# Altium schematic sheet MCU.SchDoc
size 353 x 250 mm; Date: 17.10.2024r.; Author: Bartłomiej Smoter; CompanyName: AGH Racing; Revision: v1; SheetNumber: 4; SheetTotal: 6
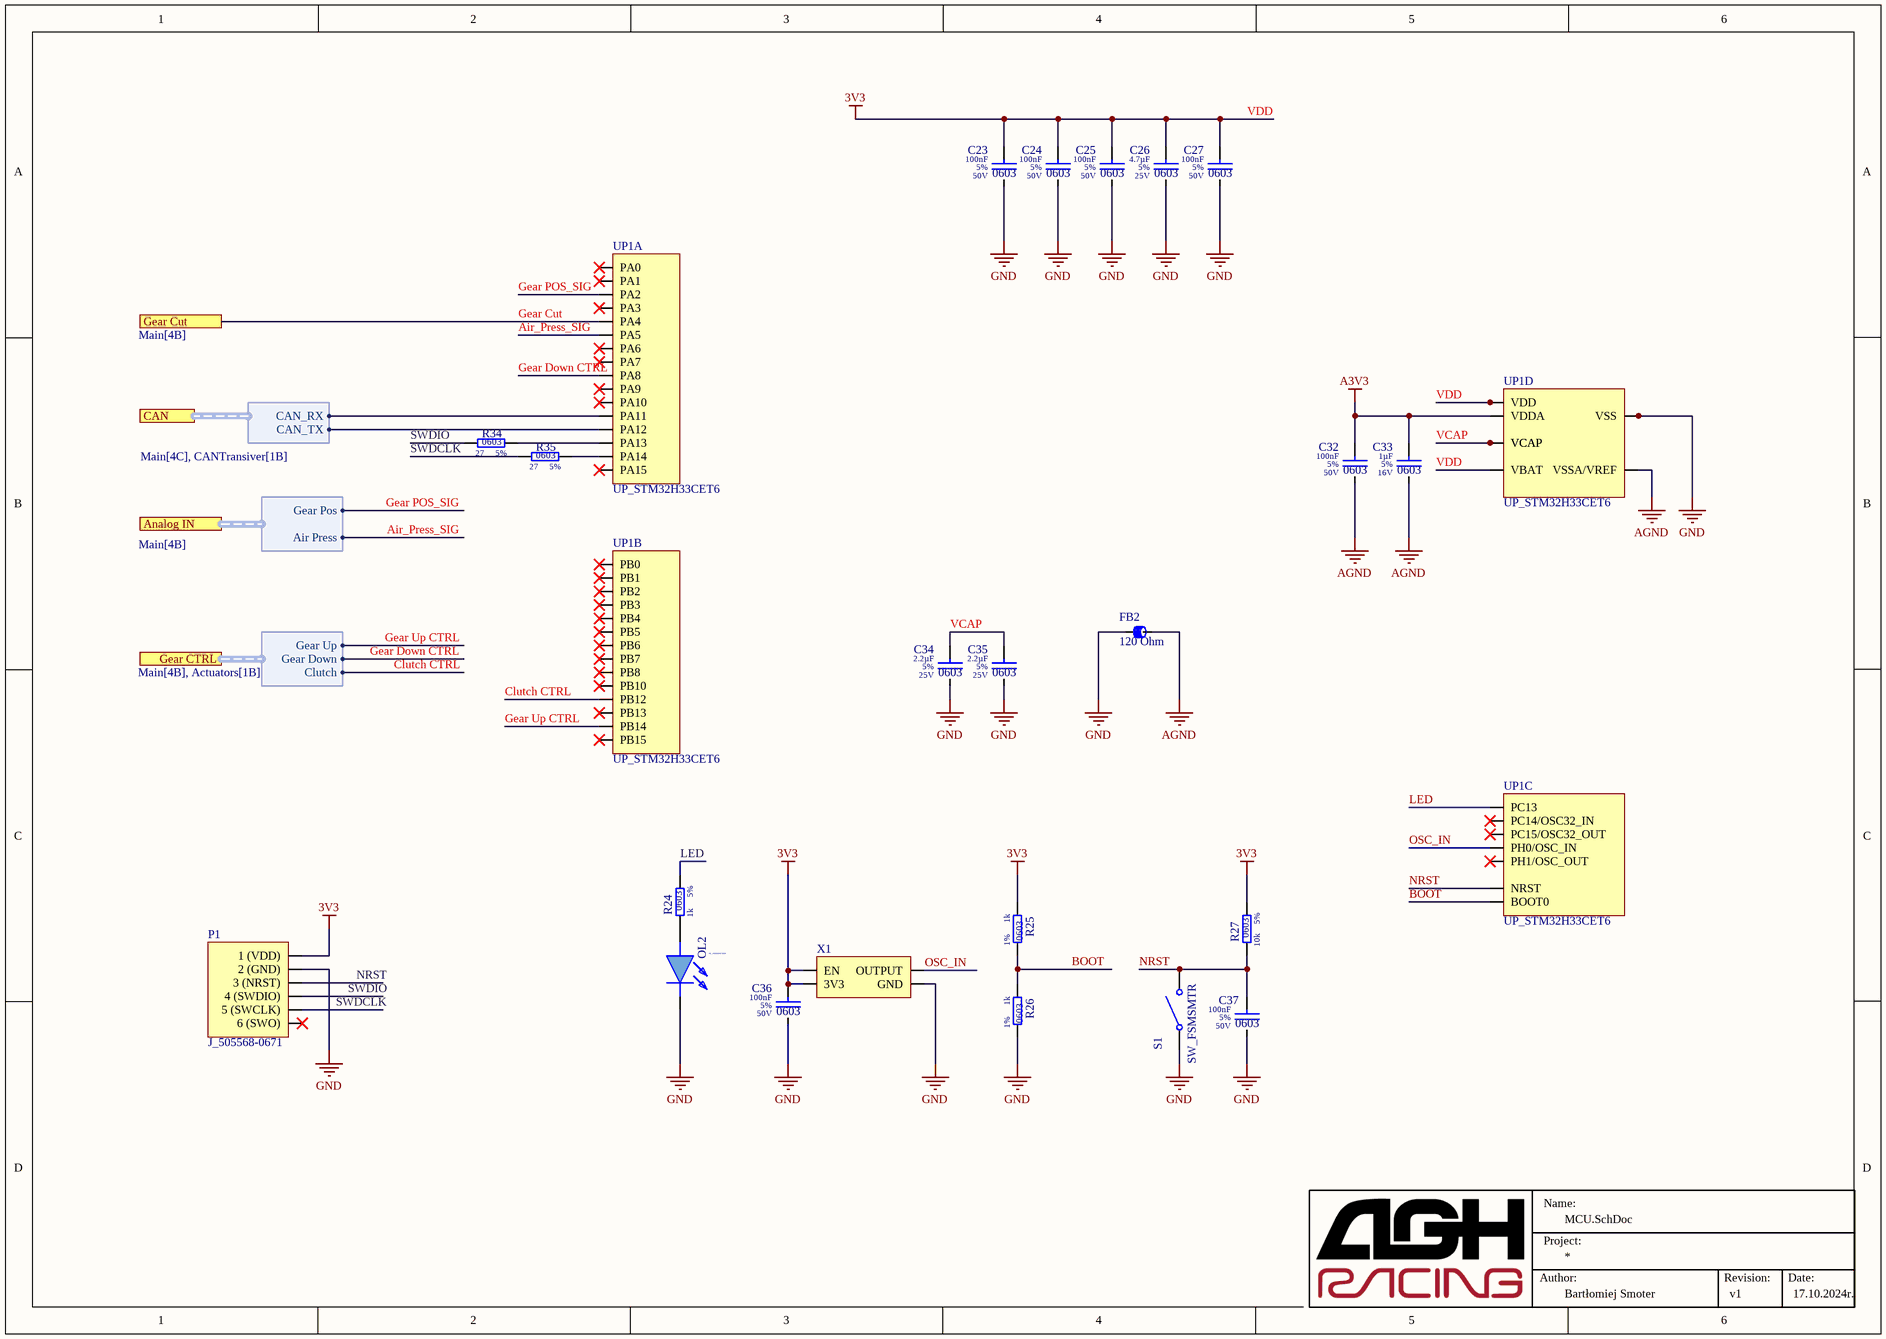
[diagram p0: MCU.SchDoc]

## Parts
C23  value 100nF  Tolerance: 5%  Voltage Rating: 50V  Case/Package: 0603  [0603_HandSold_Capacitor]  (hidden comment: C_100n_50V_0603_5)
C24  value 100nF  Tolerance: 5%  Voltage Rating: 50V  Case/Package: 0603  [0603_HandSold_Capacitor]  (hidden comment: C_100n_50V_0603_5)
C25  value 100nF  Tolerance: 5%  Voltage Rating: 50V  Case/Package: 0603  [0603_HandSold_Capacitor]  (hidden comment: C_100n_50V_0603_5)
C26  value 4.7µF  Tolerance: 5%  Voltage Rating: 25V  Case/Package: 0603  [0603_HandSold_Capacitor]  (hidden comment: C_4.7u_25V_0603_5)
C27  value 100nF  Tolerance: 5%  Voltage Rating: 50V  Case/Package: 0603  [0603_HandSold_Capacitor]  (hidden comment: C_100n_50V_0603_5)
C32  value 100nF  Tolerance: 5%  Voltage Rating: 50V  Case/Package: 0603  [0603_HandSold_Capacitor]  (hidden comment: C_100n_50V_0603_5)
C33  value 1µF  Tolerance: 5%  Voltage Rating: 16V  Case/Package: 0603  [0603_HandSold_Capacitor]  (hidden comment: C_1u_16V_0603_5)
C34  value 2.2µF  Tolerance: 5%  Voltage Rating: 25V  Case/Package: 0603  [0603_HandSold_Capacitor]  (hidden comment: C_2.2u_25V_0603_5)
C35  value 2.2µF  Tolerance: 5%  Voltage Rating: 25V  Case/Package: 0603  [0603_HandSold_Capacitor]  (hidden comment: C_2.2u_25V_0603_5)
C36  value 100nF  Tolerance: 5%  Voltage Rating: 50V  Case/Package: 0603  [0603_HandSold_Capacitor]  (hidden comment: C_100n_50V_0603_5)
C37  value 100nF  Tolerance: 5%  Voltage Rating: 50V  Case/Package: 0603  [0603_HandSold_Capacitor]  (hidden comment: C_100n_50V_0603_5)
FB2  Impedance: 120 Ohm  [0805_FB]  (hidden comment: FB_BLM21PG121SN1D)
OL2  OL_150060BS75000  [0603_HandSold_LED]
P1  J_505568-0671  [505568-0671]
R24  Tolerance: 5%  Resistance: 1k  Case/Package: 0603  [0603_HandSold_Resistor]  (hidden comment: R_1k_0603_5)
R25  Tolerance: 1%  Resistance: 1k  Case/Package: 0603  [0603_HandSold_Resistor]  (hidden comment: R_1k_0603_1)
R26  Tolerance: 1%  Resistance: 1k  Case/Package: 0603  [0603_HandSold_Resistor]  (hidden comment: R_1k_0603_1)
R27  Tolerance: 5%  Resistance: 10k  Case/Package: 0603  [0603_HandSold_Resistor]  (hidden comment: R_10k_0603_5)
R34  Tolerance: 5%  Resistance: 27  Case/Package: 0603  [0603_HandSold_Resistor]  (hidden comment: R_27_0603_5)
R35  Tolerance: 5%  Resistance: 27  Case/Package: 0603  [0603_HandSold_Resistor]  (hidden comment: R_27_0603_5)
S1  SW_FSMSMTR  [TECO-FSMSMTR_V]
UP1  UP_STM32H33CET6  [LQFP48]  (parts A,B,C,D of 4)
X1  X_16MHz_LFSPXO066657CUTT  [X_2mm_2.5mm_oscillator]  (value not drawn)

## Ports
Analog IN (harness ANAL, see Main[4B]), CAN (harness CAN, see Main[4C], CANTransiver[1B]), Gear CTRL (harness Gears, see Main[4B], Actuators[1B]), Gear Cut (see Main[4B])

## Harnesses
CAN: CAN_RX, CAN_TX
Gears: Gear Up, Gear Down, Clutch
ANAL: Gear Pos, Air Press

## Nets
A3V3: C32.1 C33.1 UP1.9(VDDA)
AGND: C32.2 C33.2 FB2.2 UP1.8(VSSA/VREF)
GND: C23.2 C24.2 C25.2 C26.2 C27.2 C34.2 C35.2 C36.2 C37.2 FB2.1 OL2.1(K) P1.2(2_(GND)) R26.2 S1.1 UP1.23(VSS) UP1.35(VSS) UP1.47(VSS) X1.2(GND)
VDD: C23.1 C24.1 C25.1 C26.1 C27.1 C36.1 P1.1(1_(VDD)) R25.1 R27.2 UP1.1(VBAT) UP1.24(VDD) UP1.36(VDD) UP1.48(VDD) X1.1(EN) X1.4(3V3)  [also labelled 3V3]
Air_Press_SIG: UP1.15(PA5) ; port Analog IN.Air Press
BOOT: R25.2 R26.1 UP1.44(BOOT0)
Clutch CTRL: UP1.25(PB12) ; port Gear CTRL.Clutch
Gear Cut: UP1.14(PA4) ; port Gear Cut
Gear Down CTRL: UP1.29(PA8) ; port Gear CTRL.Gear Down
Gear POS_SIG: UP1.12(PA2) ; port Analog IN.Gear Pos
Gear Up CTRL: UP1.27(PB14) ; port Gear CTRL.Gear Up
LED: R24.2 UP1.2(PC13)
NRST: C37.1 P1.3(3_(NRST)) R27.1 S1.2 UP1.7(NRST)
OSC_IN: UP1.5(PH0/OSC_IN) X1.3(OUTPUT)
SWDCLK: P1.5(5_(SWCLK)) R35.1
SWDIO: P1.4(4_(SWDIO)) R34.1
VCAP: C34.1 C35.1 UP1.22(VCAP) UP1.46(VCAP)
NetOL2_2: OL2.2(A) R24.1
NetR34_2: R34.2 UP1.34(PA13)
NetR35_2: R35.2 UP1.37(PA14)
NetUP1_32: UP1.32(PA11) ; port CAN.CAN_RX
NetUP1_33: UP1.33(PA12) ; port CAN.CAN_TX

Not connected (* = marked no-connect by the designer): P1 6(6_(SWO))*; UP1 3(PC14/OSC32_IN)* 4(PC15/OSC32_OUT)* 6(PH1/OSC_OUT)* 10(PA0)* 11(PA1)* 13(PA3)* 16(PA6)* 17(PA7)* 18(PB0)* 19(PB1)* 20(PB2)* 21(PB10)* 26(PB13)* 28(PB15)* 30(PA9)* 31(PA10)* 38(PA15)* 39(PB3)* 40(PB4)* 41(PB5)* 42(PB6)* 43(PB7)* 45(PB8)*

## Notes on the sheet
- Name:
- Author:
- Project:
- Revision:
- Date:

## Library data of the parts
C23-C25 C27 C32 = CMP-001-00008-26: Capacitor Type: Ceramic; Revision Num.: 1; HelpURL: https://www.tme.eu/Document/78f46414e6dac38b7cca12338ea208b0/X7RDielectric.pdf; Mounting Technology: SMT
C26 = CMP-001-00011-25: Revision Num.: 1; Capacitor Type: Ceramic; Mounting Technology: SMT; HelpURL: https://eu.mouser.com/datasheet/2/40/cx5r_KGM-3223198.pdf
C33 = CMP-001-00014-23: Revision Num.: 1; Capacitor Type: Ceramic; HelpURL: https://eu.mouser.com/datasheet/2/40/KGM_X7R-3223212.pdf; Mounting Technology: SMT
C34 C35 = CMP-001-00022-23: Capacitor Type: Ceramic; Revision Num.: 1; HelpURL: https://eu.mouser.com/datasheet/2/281/1/GRT188C71E225KE13_01A-3158366.pdf; Mounting Technology: SMT
C36 C37 = CMP-001-00008-22: Revision Num.: 1; Capacitor Type: Ceramic; Mounting Technology: SMT; HelpURL: https://www.tme.eu/Document/78f46414e6dac38b7cca12338ea208b0/X7RDielectric.pdf
FB2 = CMP-006-00000-9: Ferrite Beads 120 OHM 25% Alternate Sizing Guide Below; Revision Num.: Revision #1; ESR: 30m; Current Rating: 3A; Case/Package: 0805; HelpURL: https://www.mouser.pl/datasheet/2/281/ENFA0005-1915781.pdf; Mounting Technology: SMT; Man. Part Num.: BLM21PG121SN1D
OL2 = CMP-007-00001-11: LED 0603, Blue, 3.2V, 30mA, 105mW; Revision Num.: 1; HelpURL: https://www.we-online.com/components/products/datasheet/150060BS75000.pdf; Power: 105mW; Forward Voltage: 3.2V; Colour: Blue; Case/Package: 0603; Forward Current: 30mA; Mounting Technology: SMT; Man. Part Num.: 150060BS75000
P1 = CMP-002-00003-12: Male; Micro-Lock Plus; 6 Pos. 1.25mm; 1.5A 50V; Straight; SMT;; Mating Part Num.: 45111-0600; Pin Amount: 6; Revision Num.: 1; Mounting Style: Straight; Max Current Rating: 1.5A; Mounting Technology: SMT; Voltage Rating: 50V; Man. Part Num.: 505568-0671; Gender: Male; HelpURL: https://www.molex.com/en-us/products/part-detail/5055680671?display=pdf; Pitch: 1.25mm; Series: Micro-Lock Plus
R24 = CMP-009-00001-19: Revision Num.: 1; Voltage Rating: 75V; Power: 100mW; HelpURL: https://eu.mouser.com/datasheet/2/447/YAGEO_PYu_RC_Group_51_RoHS_L_12-3313492.pdf; Mounting Technology: SMT
R25 R26 = CMP-009-00099-4: Revision Num.: 1; Voltage Rating: 75V; Power: 100mW; HelpURL: https://www.tme.eu/Document/622e28308c06d160637f2b14751ba16b/Data%20Sheet%20CRCW_BCe3.pdf; Mounting Technology: SMT
R27 = CMP-009-00002-16: Voltage Rating: 50V; Revision Num.: 1; Power: 100mW; HelpURL: https://www.tme.eu/Document/d2a72e545e5c8eb7bf2a04fa97535928/rc0603yageo.pdf; Mounting Technology: SMT
R34 R35 = CMP-009-00038-16: Voltage Rating: 50V; Revision Num.: 1; Power: 100mW; HelpURL: https://www.mouser.pl/datasheet/2/54/cr-1858361.pdf; Mounting Technology: SMT
S1 = CMP-011-00002-8: Switch; Tact; OFF-(ON); 50mA; 24V; Revision Num.: 1; Switch Type: Tact; Man. Part Num.: FSMSMTR; Mounting Technology: SMT; HelpURL: https://www.mouser.pl/ProductDetail/TE-Connectivity-Alcoswitch/FSMSMTR?qs=UhRTNahLC3z8whMdncX%252BKw%3D%3D; Configuration: OFF-(ON); Current Rating: 50mA; Voltage Rating: 24V
UP1 = CMP-020-00018-2: MCU High-performance Arm Cortex-M33 MCU 512-Kbyte Flash 272-Kbyte RAM 250 MHz CPU; Clock Frequency: 250MHz; ROM Size: 512kB; Revision Num.: 1; Max Supply Voltage: 3.6V; Min Supply Voltage: 1.7V; RAM Size: 272kB; Series: STM32H533xx; HelpURL: https://www.google.com/url?sa=t&source=web&rct=j&opi=89978449&url=https://www.st.com/resource/en/datasheet/stm32h753vi.pdf&ved=2ahUKEwiFsajI8PeHAxUmDRAIHcL-A8EQFnoECBQQAQ&usg=AOvVaw1bta1P1SH6GWAhwR0-a_c9; Case/Package: LQFP48; Pins: 37; Mounting Technology: SMT; Man. Part Num.: STM32H33CET6
X1 = X_16MHz_LFSPXO066657CUTT-6: Frequency: 16MHz; HelpURL: https://www.tme.eu/Document/f2507c161887e0dea281275093e92f79/LFSPXO066657CUTT.pdf; Man. Part Num.: LFSPXO066657CUTT; Mounting Technology: SMT